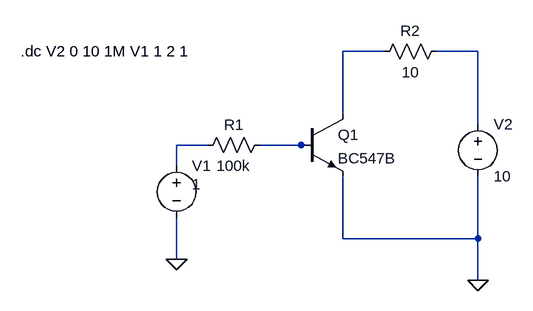
[diagram p0: schematic schemat2.asc]
schemat2.asc, the LTspice schematic file:
Version 4
SHEET 1 880 680
WIRE 16 -48 -48 -48
WIRE 160 -48 96 -48
WIRE -48 48 -48 -48
WIRE 160 64 160 -48
WIRE -256 96 -304 96
WIRE -112 96 -176 96
WIRE -96 96 -112 96
WIRE -304 128 -304 96
WIRE -48 240 -48 144
WIRE 160 240 160 144
WIRE 160 240 -48 240
WIRE -304 272 -304 208
WIRE 160 304 160 240
FLAG -304 272 0
FLAG 160 304 0
SYMBOL voltage -304 112 R0
WINDOW 3 24 44 Left 2
WINDOW 123 0 0 Left 2
WINDOW 39 0 0 Left 2
SYMATTR InstName V1
SYMATTR Value 1
SYMBOL npn -112 48 R0
SYMATTR InstName Q1
SYMATTR Value BC547B
SYMBOL res -272 112 R270
WINDOW 0 32 56 VTop 2
WINDOW 3 0 56 VBottom 2
SYMATTR InstName R1
SYMATTR Value 100k
SYMBOL voltage 160 48 R0
WINDOW 123 0 0 Left 2
WINDOW 39 0 0 Left 2
SYMATTR InstName V2
SYMATTR Value 10
SYMBOL res 0 -32 R270
WINDOW 0 32 56 VTop 2
WINDOW 3 0 56 VBottom 2
SYMATTR InstName R2
SYMATTR Value 10
TEXT -544 -48 Left 2 !.dc V2 0 10 1M V1 1 2 1

The netlist it stands for:
* schemat2.asc
V1 N003 0 1
Q1 N001 N004 0 0 BC547B
R1 N003 N004 100k
V2 N002 0 10
R2 N001 N002 10
.model NPN NPN
.model PNP PNP
.lib standard.bjt
.dc V2 0 10 1M V1 1 2 1
.backanno
.end